# EAGLE design HW2_Schematic (EAGLE 9.3.0)
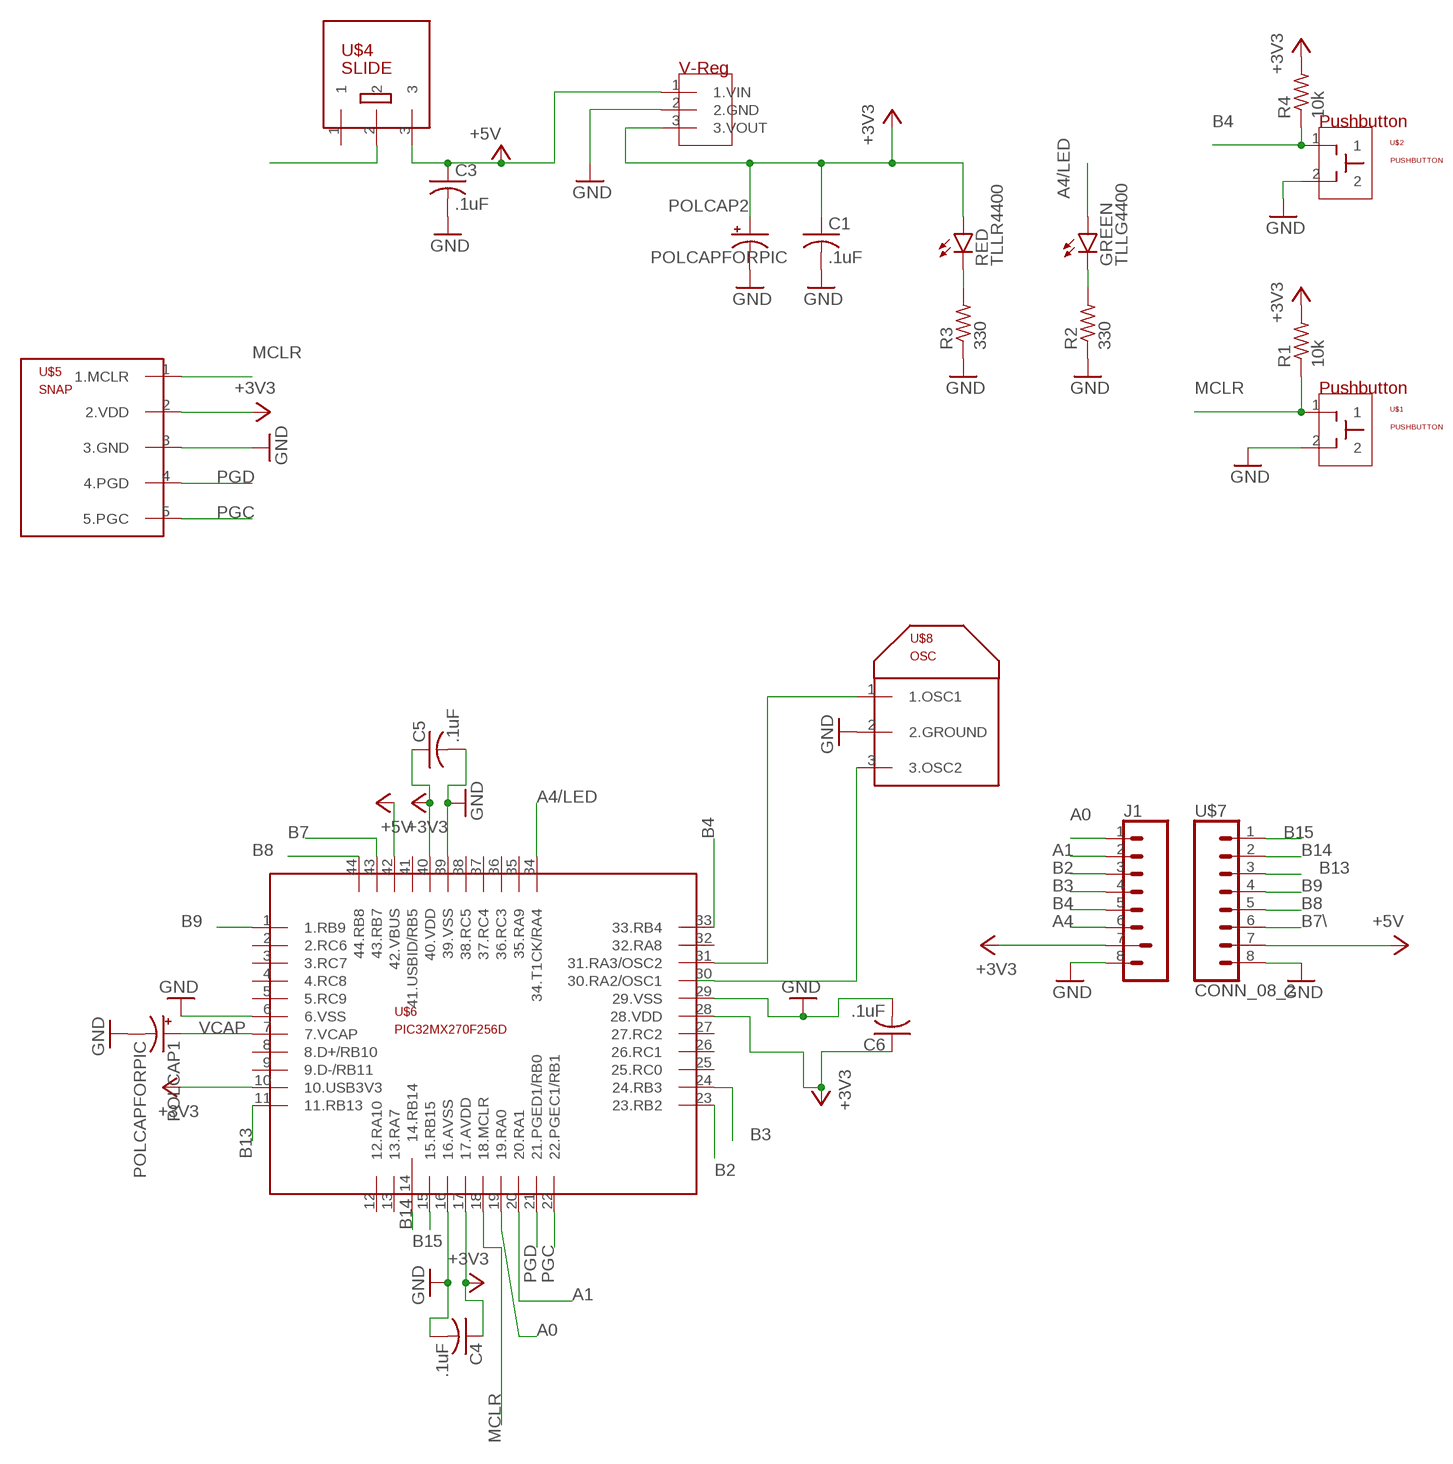
[diagram p0: schematic, sheet 1]

## Parts
C1  .1uF  C-US025-030X050  [C025-030X050]
C3  .1uF  C-US025-030X050  [C025-030X050]
C4  .1uF  C-US025-024X044  [C025-024X044]
C5  .1uF  C-US025-024X044  [C025-024X044]
C6  .1uF  C-US025-024X044  [C025-024X044]
GREEN  TLLG4400  [LED3MM]
J1  CONN_08  [CONN08]
POLCAP1  POLCAPFORPIC  [POLARIZEDCAPFORPIC]
POLCAP2  POLCAPFORPIC  [POLARIZEDCAPFORPIC]
R1  10k  R-US_0207/10  [0207/10]
R2  330  R-US_0207/10  [0207/10]
R3  330  R-US_0207/10  [0207/10]
R4  10k  R-US_0207/10  [0207/10]
RED  TLLR4400  [LED3MM]
U$1  PUSHBUTTON  [PUSHBUTTON]
U$2  PUSHBUTTON  [PUSHBUTTON]
U$3  VOTAGEREG  [V-REG]
U$4  SLIDE  [SLIDE]
U$5  SNAP  [SNAP]
U$6  PIC32MX270F256D  [PIC_44-PIN]
U$7  CONN_08_2  [CONN08]
U$8  OSC  [OSC]

## Nets
+3V3: C1.1 C4.1 C5.1 C6.1 J1.7(7.3V3) POLCAP2.1(+) R1.2 R4.2 RED.A U$3.3(3.VOUT) U$5.2(2.VDD) U$6.10(10.USB3V3) U$6.17(17.AVDD) U$6.28(28.VDD) U$6.40(40.VDD)
+5V: C3.1 U$3.1(1.VIN) U$4.3 U$6.42(42.VBUS) U$7.7(7.5V)
A0: J1.1(1.A0) U$6.19(19.RA0)
A1: J1.2(2.A1) U$6.20(20.RA1)
A4: J1.6(6.A4)
A4/LED: GREEN.A U$6.34(34.T1CK/RA4)
B2: J1.3(3.B2) U$6.23(23.RB2)
B3: J1.4(4.B3) U$6.24(24.RB3)
B4: J1.5(5.B4) R4.1 U$2.1 U$6.33(33.RB4)
B7: U$6.43(43.RB7)
B7\: U$7.6(6.B7)
B8: U$6.44(44.RB8) U$7.5(5.B8)
B9: U$6.1(1.RB9) U$7.4(4.B9)
B13: U$6.11(11.RB13) U$7.3(3.B13)
B14: U$6.14(14.RB14) U$7.2(2.B14)
B15: U$6.15(15.RB15) U$7.1(1.B15)
GND: C1.2 C3.2 C4.2 C5.2 C6.2 J1.8(8.GND) POLCAP1.2(-) POLCAP2.2(-) R2.1 R3.1 U$1.2 U$2.2 U$3.2(2.GND) U$5.3(3.GND) U$6.6(6.VSS) U$6.16(16.AVSS) U$6.29(29.VSS) U$6.39(39.VSS) U$7.8(8.GND) U$8.2(2.GROUND)
MCLR: R1.1 U$1.1 U$5.1(1.MCLR) U$6.18(18.MCLR)
N$1: GREEN.K(C) R2.2
N$2: R3.2 RED.K(C)
N$3: U$4.2
N$4: U$6.30(30.RA2/OSC1) U$8.3(3.OSC2)
N$5: U$6.31(31.RA3/OSC2) U$8.1(1.OSC1)
PGC: U$5.5(5.PGC) U$6.22(22.PGEC1/RB1)
PGD: U$5.4(4.PGD) U$6.21(21.PGED1/RB0)
VCAP: POLCAP1.1(+) U$6.7(7.VCAP)
Unconnected: U$4.1 U$6.2(2.RC6) U$6.3(3.RC7) U$6.4(4.RC8) U$6.5(5.RC9) U$6.8(8.D+/RB10) U$6.9(9.D-/RB11) U$6.12(12.RA10) U$6.13(13.RA7) U$6.25(25.RC0) U$6.26(26.RC1) U$6.27(27.RC2) U$6.32(32.RA8) U$6.35(35.RA9) U$6.36(36.RC3) U$6.37(37.RC4) U$6.38(38.RC5) U$6.41(41.USBID/RB5)

## Library data of the parts
C1 C3 = rcl:C-US: CAPACITOR, American symbol; SPICEPREFIX: C
C4-C6 = HW2_Library:C-US: CAPACITOR, American symbol; SPICEPREFIX: C
GREEN = HW2_Library:TLLG4400: Low Current (2mA) LED 3 mm Tinted Diffused Package color GREEN Source: Data sheet <http://www.farnell.com/datasheets/391098.pdf>; MF: VISHAY SEMICONDUCTOR; OC_FARNELL: 1612435
J1 = HW2_Library:CONN_08: Multi connection point. Often used as Generic Header-pin footprint for 0.1 inch spaced/style header connections On any of the 0.1 inch spaced packages, you can populate with these: Break Away Headers - Straight <https://www.sparkfun.com/products/116> (PRT-00116) Break Away Male Headers - Right Angle <https://www.sparkfun.com/products/553> (PRT-00553) Female Headers <https://www.sparkfun.com/products/115> (PRT-00115) Break Away Headers - Machine Pin <https://www.sparkfun.com/products/117> (PRT-00117) Break Away Female Headers - Swiss Machine Pin <https://www.sparkfun.com/products/743> (PRT-00743) Arduino Stackable Header - 8 Pin <https://www.sparkfun.com/products/9279> (PRT-09279) For SCREWTERMINALS and SPRING TERMINALS visit here: Screw Terimnals on SparkFun.com <https://www.sparkfun.com/search/results?term=Screw+Terminals> (5mm/3.5mm/2.54mm spacing) This device is also useful as a general connection point to wire up your design to another part of your project. Our various solder wires solder well into these plated through hole pads. Hook-Up Wire - Assortment (Stranded, 22 AWG) <https://www.sparkfun.com/products/11375> (PRT-11375) Hook-Up Wire - Assortment (Solid Core, 22 AWG) <https://www.sparkfun.com/products/11367> (PRT-11367) View the entire wire category on our website here <https://www.sparkfun.com/categories/141> Special notes: Molex polarized connector foot print use with SKU : PRT-08231 with associated crimp pins and housings. 1MM SMD Version SKU: PRT-10208 NOTES ON THE VARIANTS LOCK and LOCK_LONGPADS... This footprint was designed to help hold the alignment of a through-hole component (i.e. 6-pin header) while soldering it into place. You may notice that each hole has been shifted either up or down by 0.005 of an inch from it's more standard position (which is a perfectly straight line). This slight alteration caused the pins (the squares in the middle) to touch the edges of the holes. Because they are alternating, it causes a "brace" to hold the component in place. 0.005 has proven to be the perfect amount of "off-center" position when using our standard breakaway headers. Although looks a little odd when you look at the bare footprint, once you have a header in there, the alteration is very hard to notice. Also,if you push a header all the way into place, it is covered up entirely on the bottom side.
POLCAP1 POLCAP2 = HW2_Library:POLCAPFORPIC
R1-R4 = rcl:R-US_: RESISTOR, American symbol; SPICEPREFIX: R
RED = HW2_Library:TLLR4400: Low Current (2mA) LED 3 mm Tinted Diffused Package color RED Source: Data sheet <http://www.farnell.com/datasheets/391100.pdf>; MF: VISHAY SEMICONDUCTOR; OC_FARNELL: 1612437
U$1 U$2 = HW2_Library:PUSHBUTTON
U$3 = HW2_Library:VOTAGEREG
U$4 = HW2_Library:SLIDE
U$5 = HW2_Library:SNAP
U$6 = HW2_Library:PIC32MX270F256D
U$7 = HW2_Library:CONN_08_2
U$8 = HW2_Library:OSC

## Board
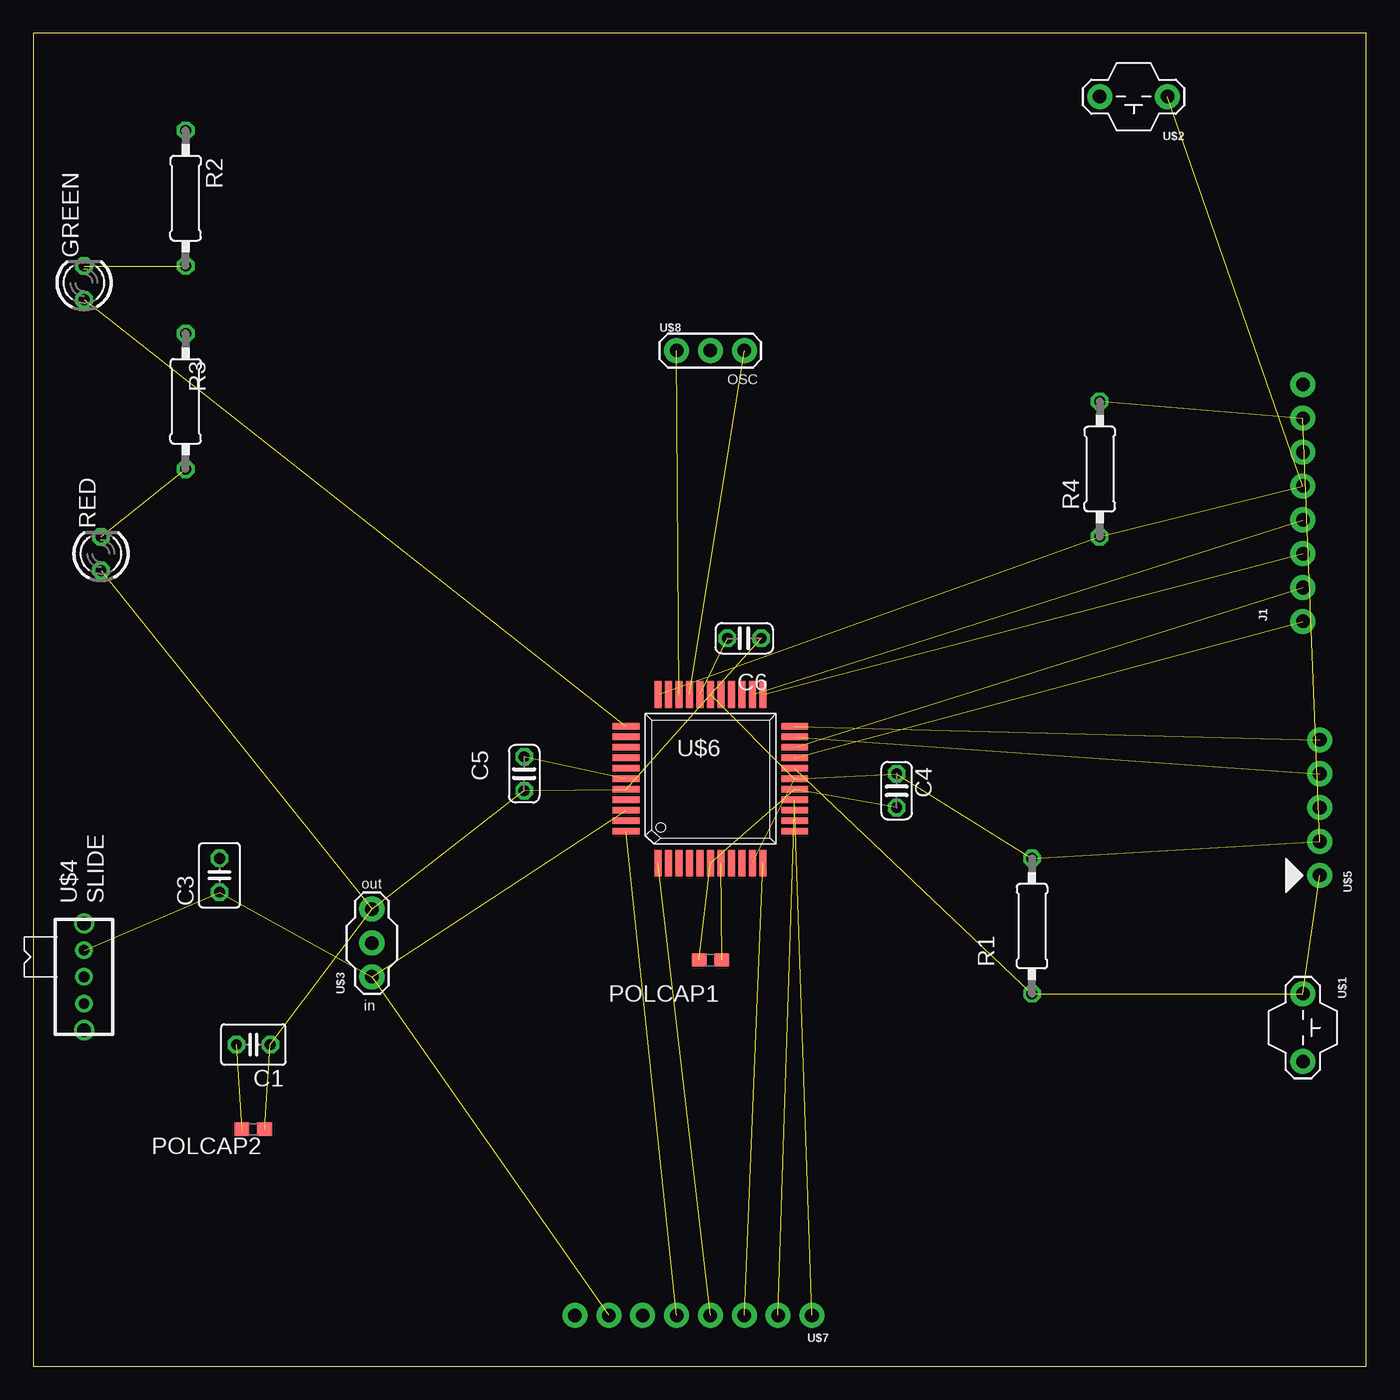
[diagram p1: board, top side]
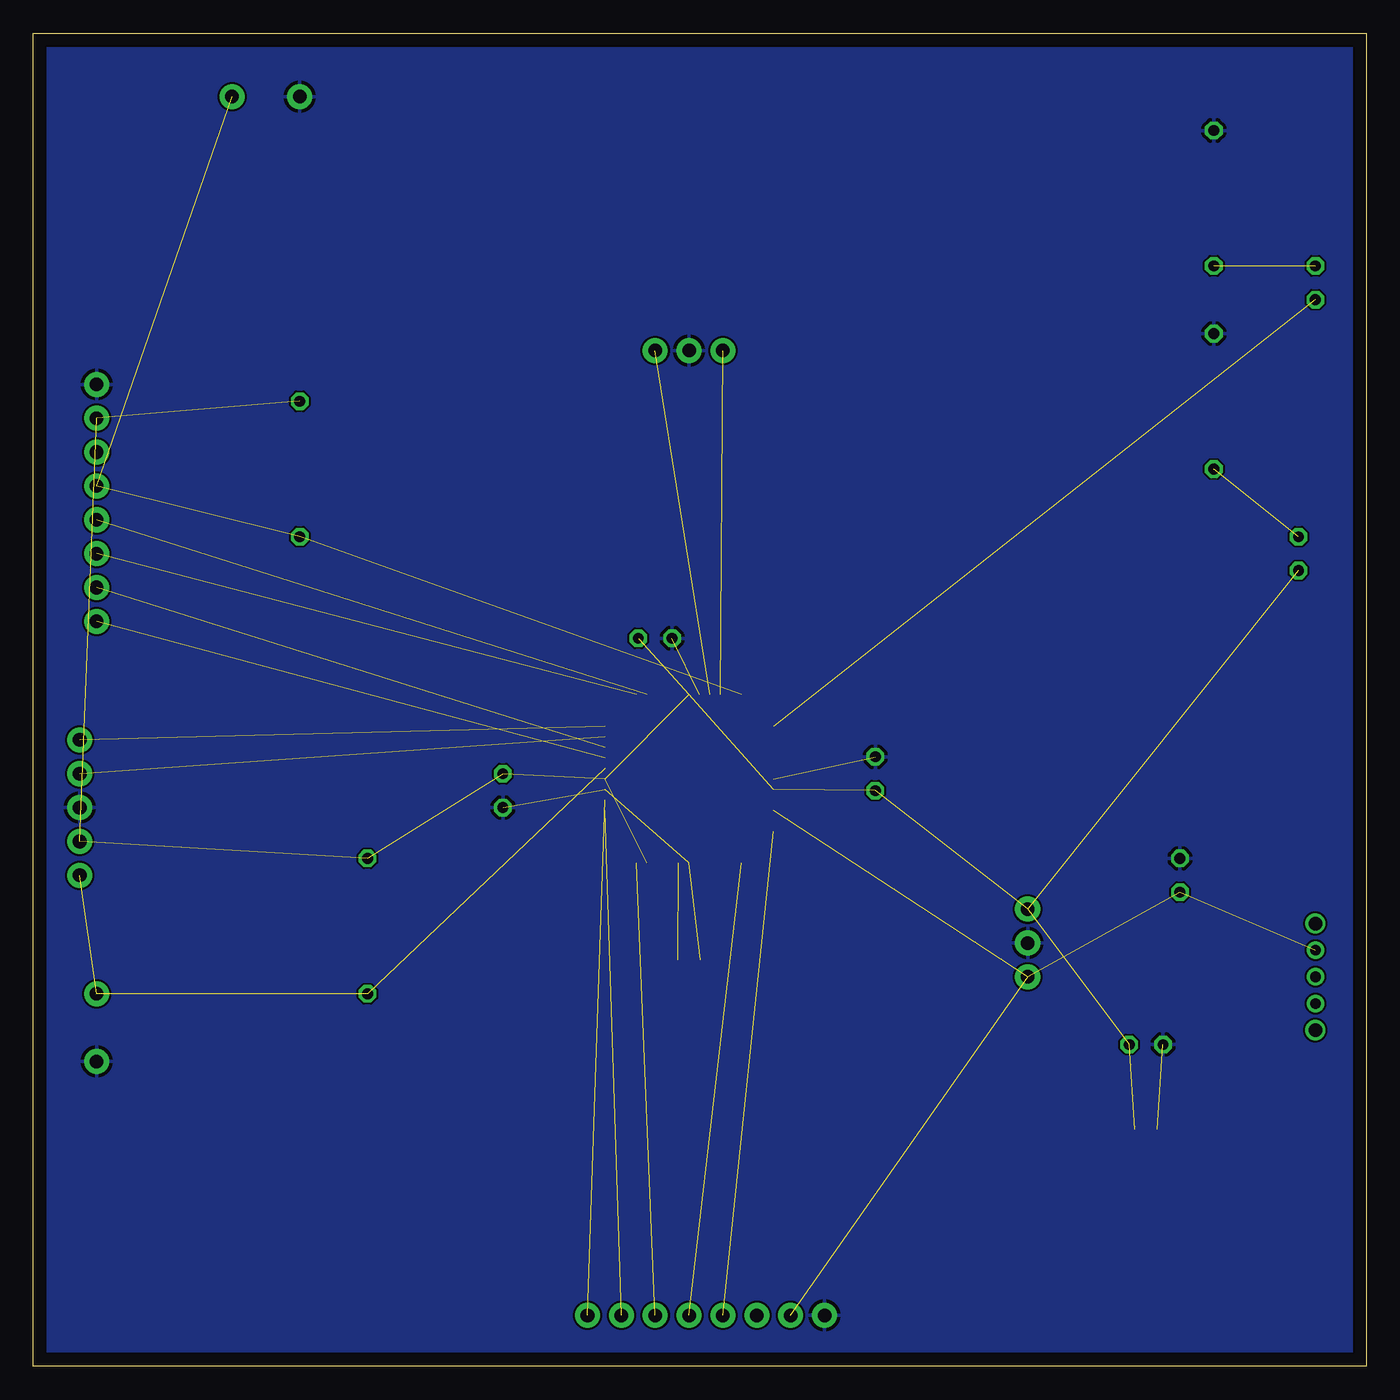
[diagram p2: board, bottom side, seen from below]

Size 100 x 100 mm. Coordinates in mm from the lower left corner, seen from the top.
Outline: 0,0 100,0 100,100 0,100 0,0
Copper layers (1*16): Top 0.035mm / dielectric 1.5mm / Bottom 0.035mm
Design rules "default": minimum track width 6mil, minimum drill 0.35mm, track to track 6mil, track to pad 6mil, pad to pad 6mil, via to via 6mil, smd to smd 6mil, copper to edge 40mil, drill to drill 6mil, minimum pad ring 10mil, minimum via ring 8mil, stop-mask expansion 4mil, vias tented up to drill 0mil, thermal gap 10mil

### Footprints (pad centres in the part's own frame; a part is rotated, then mirrored left to right if it is on the bottom)
C025-030X050 = drill 0.813 octagon: 1 -1.27,0; 2 1.27,0
C025-024X044 = drill 0.813 octagon: 1 -1.27,0; 2 1.27,0
LED3MM = drill 0.813 octagon: A -1.27,0; K 1.27,0
CONN08 = drill 1.016 pad 1.88: 1 0,0; 2 2.54,0; 3 5.08,0; 4 7.62,0; 5 10.16,0; 6 12.7,0; 7 15.24,0; 8 17.78,0
POLARIZEDCAPFORPIC = smd 1.1 x 1: 1 -0.85,0; 2 0.85,0
0207/10 = drill 0.813 octagon: 1 -5.08,0; 2 5.08,0
PUSHBUTTON = drill 1.016 pad 1.88: 1 0,0; 2 5.08,0
V-REG = drill 1.016 pad 1.88: 1 0,0; 2 2.54,0; 3 5.08,0
SLIDE = drill 0.8: 1 -2,0; 2 0,0; 3 2,0 | drill 1: P$1 -4,0; P$2 4,0
SNAP = drill 1.016 pad 1.88: 1 0,0; 2 2.54,0; 3 5.08,0; 4 7.62,0; 5 10.16,0
PIC_44-PIN = smd 0.508 x 2.007: 1 -3.937,-6.706; 2 -3.15,-6.706; 3 -2.362,-6.706; 4 -1.575,-6.706; 5 -0.787,-6.706; 6 0,-6.706; 7 0.787,-6.706; 8 1.575,-6.706; 9 2.362,-6.706; 10 3.15,-6.706; 11 3.937,-6.706; 23 3.937,5.944; 24 3.15,5.944; 25 2.362,5.944; 26 1.575,5.944; 27 0.787,5.944; 28 0,5.944; 29 -0.787,5.944; 30 -1.575,5.944; 31 -2.362,5.944; 32 -3.15,5.944; 33 -3.937,5.944 | smd 2.007 x 0.508: 12 6.325,-4.318; 13 6.325,-3.531; 14 6.325,-2.743; 15 6.325,-1.956; 16 6.325,-1.168; 17 6.325,-0.381; 18 6.325,0.406; 19 6.325,1.194; 20 6.325,1.981; 21 6.325,2.769; 22 6.325,3.556; 34 -6.325,3.556; 35 -6.325,2.769; 36 -6.325,1.981; 37 -6.325,1.194; 38 -6.325,0.406; 39 -6.325,-0.381; 40 -6.325,-1.168; 41 -6.325,-1.956; 42 -6.325,-2.743; 43 -6.325,-3.531; 44 -6.325,-4.318
OSC = drill 1.016 pad 1.88: 1 0,0; 2 2.54,0; 3 5.08,0

### Placement (x,y rotation side)
C1  16.51,24.13 180 top
C3  13.97,36.83 90 top
C4  64.77,43.18 270 top
C5  36.83,44.45 90 top
C6  53.34,54.61 180 top
GREEN  3.81,81.28 90 top
J1  95.25,55.88 90 top
POLCAP1  50.8,30.48 180 top
POLCAP2  16.51,17.78 180 top
R1  74.93,33.02 90 top
R2  11.43,87.63 270 top
R3  11.43,72.39 270 top
R4  80.01,67.31 90 top
RED  5.08,60.96 90 top
U$1  95.25,27.94 270 top
U$2  85.09,95.25 180 top
U$3  25.4,29.21 90 top
U$4  3.81,29.21 90 top
U$5  96.52,36.83 90 top
U$6  50.8,44.45 0 top
U$7  58.42,3.81 180 top
U$8  48.26,76.2 0 top

### Tracks (layer width: path | path; a pad name or v marks a point on that pad's centre or on a via)
+3V3  (14 unrouted)
+5V  (4 unrouted)
A0  (1 unrouted)
A1  (1 unrouted)
A4/LED  (1 unrouted)
B2  (1 unrouted)
B3  (1 unrouted)
B4  (3 unrouted)
B8  (1 unrouted)
B9  (1 unrouted)
B13  (1 unrouted)
B14  (1 unrouted)
B15  (1 unrouted)
GND  (6 unrouted)
  pour Bottom: -3.81,96.52 -5.08,96.52 -7.62,93.98 -7.62,-1.27 106.68,-1.27 106.68,104.14 107.95,105.41 2.54,105.41
MCLR  (3 unrouted)
N$1  (1 unrouted)
N$2  (1 unrouted)
N$4  (1 unrouted)
N$5  (1 unrouted)
PGC  (1 unrouted)
PGD  (1 unrouted)
VCAP  (1 unrouted)